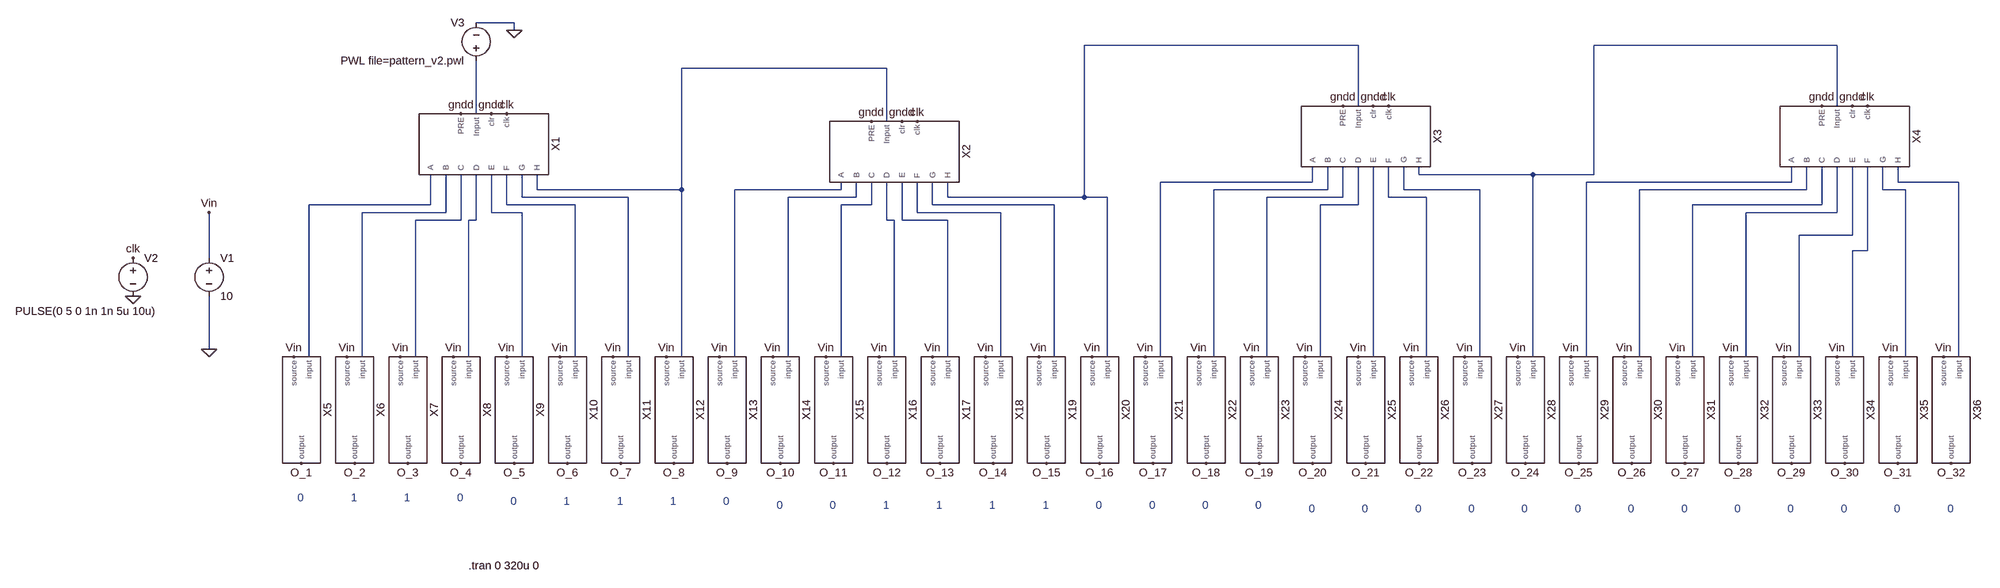
[diagram p0: schematic arduino_control_solarcell.asc]
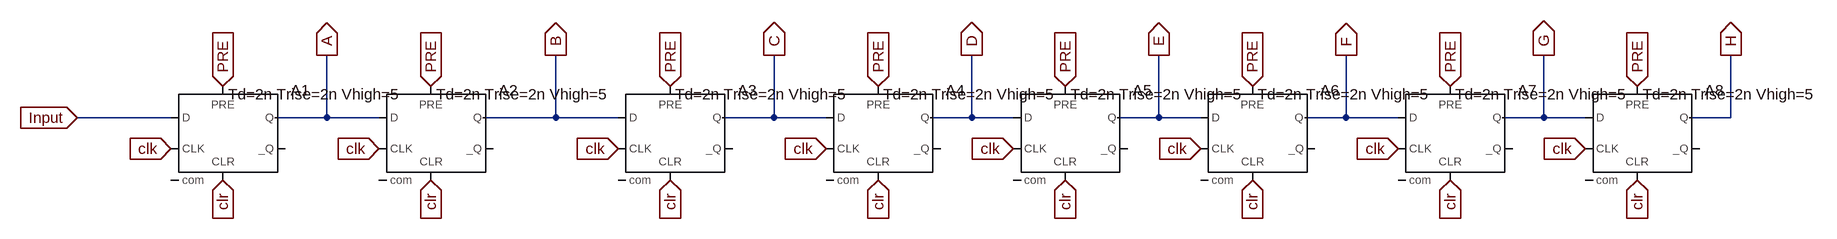
[diagram p1: sub-circuit shift_register.asc]
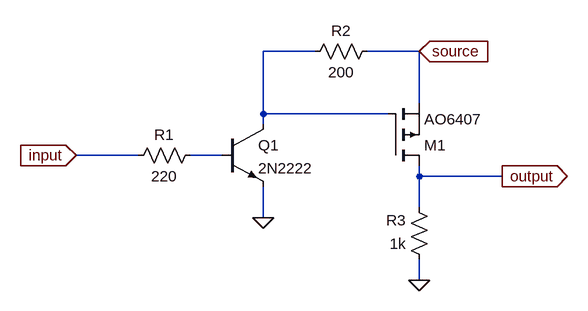
[diagram p2: sub-circuit bloc_transistor.asc]
arduino_control_solarcell.asc, the LTspice schematic file:
Version 4.1
SHEET 1 3296 1164
WIRE -64 -272 -144 -272
WIRE -64 -256 -64 -272
WIRE 1712 -224 1136 -224
WIRE 2720 -224 2208 -224
WIRE 720 -176 288 -176
WIRE 1712 -96 1712 -224
WIRE 2720 -96 2720 -224
WIRE -144 -80 -144 -192
WIRE 720 -64 720 -176
WIRE 1840 48 1840 32
WIRE 2080 48 1840 48
WIRE 2208 48 2208 -224
WIRE 2208 48 2080 48
WIRE 1616 64 1616 32
WIRE 1616 64 1296 64
WIRE 2624 64 2624 32
WIRE 2624 64 2192 64
WIRE 2848 64 2848 32
WIRE 2976 64 2848 64
WIRE -16 80 -16 48
WIRE 288 80 288 -176
WIRE 288 80 -16 80
WIRE 624 80 624 64
WIRE 624 80 400 80
WIRE 1648 80 1648 32
WIRE 1648 80 1408 80
WIRE 1808 80 1808 32
WIRE 1968 80 1808 80
WIRE 2656 80 2656 32
WIRE 2656 80 2304 80
WIRE 2816 80 2816 32
WIRE 2864 80 2816 80
WIRE -48 96 -48 48
WIRE 176 96 -48 96
WIRE 656 96 656 64
WIRE 656 96 512 96
WIRE 848 96 848 64
WIRE 1136 96 1136 -224
WIRE 1136 96 848 96
WIRE 1184 96 1136 96
WIRE 1680 96 1680 32
WIRE 1680 96 1520 96
WIRE 1776 96 1776 32
WIRE 1856 96 1776 96
WIRE -240 112 -240 48
WIRE -240 112 -496 112
WIRE -80 112 -80 48
WIRE 64 112 -80 112
WIRE 688 112 688 64
WIRE 688 112 624 112
WIRE 816 112 816 64
WIRE 1072 112 816 112
WIRE 1712 112 1712 32
WIRE 1712 112 1632 112
WIRE 2688 112 2688 32
WIRE 2688 112 2416 112
WIRE -208 128 -208 48
WIRE -208 128 -384 128
WIRE -112 128 -112 48
WIRE -48 128 -112 128
WIRE 784 128 784 64
WIRE 960 128 784 128
WIRE 2720 128 2720 32
WIRE 2720 128 2528 128
WIRE -176 144 -176 48
WIRE -176 144 -272 144
WIRE -144 144 -144 48
WIRE -144 144 -160 144
WIRE 720 144 720 64
WIRE 736 144 720 144
WIRE 752 144 752 64
WIRE 848 144 752 144
WIRE 2752 176 2752 32
WIRE 2752 176 2640 176
WIRE 2784 208 2784 32
WIRE 2784 208 2752 208
WIRE -928 224 -928 128
WIRE -928 416 -928 304
WIRE -496 432 -496 112
WIRE -384 432 -384 128
WIRE -272 432 -272 144
WIRE -160 432 -160 144
WIRE -48 432 -48 128
WIRE 64 432 64 112
WIRE 176 432 176 96
WIRE 288 432 288 80
WIRE 400 432 400 80
WIRE 512 432 512 96
WIRE 624 432 624 112
WIRE 736 432 736 144
WIRE 848 432 848 144
WIRE 960 432 960 128
WIRE 1072 432 1072 112
WIRE 1184 432 1184 96
WIRE 1296 432 1296 64
WIRE 1408 432 1408 80
WIRE 1520 432 1520 96
WIRE 1632 432 1632 112
WIRE 1744 432 1744 32
WIRE 1856 432 1856 96
WIRE 1968 432 1968 80
WIRE 2080 432 2080 48
WIRE 2192 432 2192 64
WIRE 2304 432 2304 80
WIRE 2416 432 2416 112
WIRE 2528 432 2528 128
WIRE 2640 432 2640 176
WIRE 2752 432 2752 208
WIRE 2864 432 2864 80
WIRE 2976 432 2976 64
FLAG -928 416 0
FLAG -928 128 Vin
FLAG -512 656 O_1
FLAG -400 656 O_2
FLAG -288 656 O_3
FLAG -176 656 O_4
FLAG -64 656 O_5
FLAG 48 656 O_6
FLAG 160 656 O_7
FLAG 272 656 O_8
FLAG 384 656 O_9
FLAG 496 656 O_10
FLAG 608 656 O_11
FLAG 720 656 O_12
FLAG 832 656 O_13
FLAG 944 656 O_14
FLAG 1056 656 O_15
FLAG 1168 656 O_16
FLAG 1280 656 O_17
FLAG 1392 656 O_18
FLAG 1504 656 O_19
FLAG 1616 656 O_20
FLAG 1728 656 O_21
FLAG 1840 656 O_22
FLAG 1952 656 O_23
FLAG 2064 656 O_24
FLAG 2176 656 O_25
FLAG 2288 656 O_26
FLAG 2400 656 O_27
FLAG 2512 656 O_28
FLAG 2624 656 O_29
FLAG 2736 656 O_30
FLAG 2848 656 O_31
FLAG 2960 656 O_32
FLAG -1088 224 clk
FLAG -80 -80 clk
FLAG 784 -64 clk
FLAG 1776 -96 clk
FLAG 2784 -96 clk
FLAG -112 -80 gndd
FLAG -176 -80 gndd
FLAG 752 -64 gndd
FLAG 688 -64 gndd
FLAG 1744 -96 gndd
FLAG 1680 -96 gndd
FLAG 2752 -96 gndd
FLAG 2688 -96 gndd
FLAG -1088 304 0
FLAG -64 -256 0
FLAG -528 432 Vin
FLAG -416 432 Vin
FLAG -304 432 Vin
FLAG -192 432 Vin
FLAG -80 432 Vin
FLAG 32 432 Vin
FLAG 144 432 Vin
FLAG 256 432 Vin
FLAG 368 432 Vin
FLAG 480 432 Vin
FLAG 592 432 Vin
FLAG 704 432 Vin
FLAG 816 432 Vin
FLAG 928 432 Vin
FLAG 1040 432 Vin
FLAG 1152 432 Vin
FLAG 1264 432 Vin
FLAG 1376 432 Vin
FLAG 1488 432 Vin
FLAG 1600 432 Vin
FLAG 1712 432 Vin
FLAG 1824 432 Vin
FLAG 1936 432 Vin
FLAG 2048 432 Vin
FLAG 2160 432 Vin
FLAG 2272 432 Vin
FLAG 2384 432 Vin
FLAG 2496 432 Vin
FLAG 2608 432 Vin
FLAG 2720 432 Vin
FLAG 2832 432 Vin
FLAG 2944 432 Vin
SYMBOL voltage -928 208 R0
WINDOW 123 0 0 Left 0
WINDOW 39 0 0 Left 0
SYMATTR InstName V1
SYMATTR Value 10
SYMBOL voltage -1088 208 R0
WINDOW 3 -248 128 Left 2
WINDOW 123 0 0 Left 0
WINDOW 39 0 0 Left 0
SYMATTR Value PULSE(0 5 0 1n 1n 5u 10u)
SYMATTR InstName V2
SYMBOL voltage -144 -176 R180
WINDOW 0 24 96 Left 2
WINDOW 3 24 16 Left 2
WINDOW 123 0 0 Left 0
WINDOW 39 0 0 Left 0
SYMATTR InstName V3
SYMATTR Value PWL file=pattern_v2.pwl
SYMBOL shift_register -128 -16 R90
SYMATTR InstName X1
SYMBOL shift_register 736 0 R90
SYMATTR InstName X2
SYMBOL shift_register 1728 -32 R90
SYMATTR InstName X3
SYMBOL shift_register 2736 -32 R90
SYMATTR InstName X4
SYMBOL bloc_transistor -512 544 R90
SYMATTR InstName X5
SYMBOL bloc_transistor -400 544 R90
SYMATTR InstName X6
SYMBOL bloc_transistor -288 544 R90
SYMATTR InstName X7
SYMBOL bloc_transistor -176 544 R90
SYMATTR InstName X8
SYMBOL bloc_transistor -64 544 R90
SYMATTR InstName X9
SYMBOL bloc_transistor 48 544 R90
SYMATTR InstName X10
SYMBOL bloc_transistor 160 544 R90
SYMATTR InstName X11
SYMBOL bloc_transistor 272 544 R90
SYMATTR InstName X12
SYMBOL bloc_transistor 384 544 R90
SYMATTR InstName X13
SYMBOL bloc_transistor 496 544 R90
SYMATTR InstName X14
SYMBOL bloc_transistor 608 544 R90
SYMATTR InstName X15
SYMBOL bloc_transistor 720 544 R90
SYMATTR InstName X16
SYMBOL bloc_transistor 832 544 R90
SYMATTR InstName X17
SYMBOL bloc_transistor 944 544 R90
SYMATTR InstName X18
SYMBOL bloc_transistor 1056 544 R90
SYMATTR InstName X19
SYMBOL bloc_transistor 1168 544 R90
SYMATTR InstName X20
SYMBOL bloc_transistor 1280 544 R90
SYMATTR InstName X21
SYMBOL bloc_transistor 1392 544 R90
SYMATTR InstName X22
SYMBOL bloc_transistor 1504 544 R90
SYMATTR InstName X23
SYMBOL bloc_transistor 1616 544 R90
SYMATTR InstName X24
SYMBOL bloc_transistor 1728 544 R90
SYMATTR InstName X25
SYMBOL bloc_transistor 1840 544 R90
SYMATTR InstName X26
SYMBOL bloc_transistor 1952 544 R90
SYMATTR InstName X27
SYMBOL bloc_transistor 2064 544 R90
SYMATTR InstName X28
SYMBOL bloc_transistor 2176 544 R90
SYMATTR InstName X29
SYMBOL bloc_transistor 2288 544 R90
SYMATTR InstName X30
SYMBOL bloc_transistor 2400 544 R90
SYMATTR InstName X31
SYMBOL bloc_transistor 2512 544 R90
SYMATTR InstName X32
SYMBOL bloc_transistor 2624 544 R90
SYMATTR InstName X33
SYMBOL bloc_transistor 2736 544 R90
SYMATTR InstName X34
SYMBOL bloc_transistor 2848 544 R90
SYMATTR InstName X35
SYMBOL bloc_transistor 2960 544 R90
SYMATTR InstName X36
TEXT -160 1048 Left 2 !.tran 0 320u 0
TEXT -520 728 Left 2 ;0
TEXT -408 728 Left 2 ;1
TEXT -296 728 Left 2 ;1
TEXT -184 728 Left 2 ;0
TEXT -72 736 Left 2 ;0
TEXT 40 736 Left 2 ;1
TEXT 152 736 Left 2 ;1
TEXT 264 736 Left 2 ;1
TEXT 376 736 Left 2 ;0
TEXT 488 744 Left 2 ;0
TEXT 600 744 Left 2 ;0
TEXT 712 744 Left 2 ;1
TEXT 824 744 Left 2 ;1
TEXT 936 744 Left 2 ;1
TEXT 1048 744 Left 2 ;1
TEXT 1160 744 Left 2 ;0
TEXT 1272 744 Left 2 ;0
TEXT 1384 744 Left 2 ;0
TEXT 1496 744 Left 2 ;0
TEXT 1608 752 Left 2 ;0
TEXT 1720 752 Left 2 ;0
TEXT 1832 752 Left 2 ;0
TEXT 1944 752 Left 2 ;0
TEXT 2056 752 Left 2 ;0
TEXT 2168 752 Left 2 ;0
TEXT 2280 752 Left 2 ;0
TEXT 2392 752 Left 2 ;0
TEXT 2504 752 Left 2 ;0
TEXT 2616 752 Left 2 ;0
TEXT 2728 752 Left 2 ;0
TEXT 2840 752 Left 2 ;0
TEXT 2952 752 Left 2 ;0

shift_register.asc, the sub-circuit schematic file:
Version 4.1
SHEET 1 2264 680
WIRE -320 112 -464 112
WIRE -80 112 -80 16
WIRE -80 112 -160 112
WIRE 0 112 -80 112
WIRE 272 112 272 16
WIRE 272 112 160 112
WIRE 368 112 272 112
WIRE 608 112 608 16
WIRE 608 112 528 112
WIRE 688 112 608 112
WIRE 912 112 912 16
WIRE 912 112 848 112
WIRE 976 112 912 112
WIRE 1200 112 1200 16
WIRE 1200 112 1136 112
WIRE 1264 112 1200 112
WIRE 1488 112 1488 16
WIRE 1488 112 1424 112
WIRE 1568 112 1488 112
WIRE 1792 112 1792 16
WIRE 1792 112 1728 112
WIRE 1856 112 1792 112
WIRE 2080 112 2080 16
WIRE 2080 112 2016 112
FLAG 0 160 clk
IOPIN 0 160 In
FLAG 368 160 clk
IOPIN 368 160 In
FLAG -320 160 clk
IOPIN -320 160 In
FLAG 688 160 clk
IOPIN 688 160 In
FLAG 976 160 clk
IOPIN 976 160 In
FLAG 1264 160 clk
IOPIN 1264 160 In
FLAG 1568 160 clk
IOPIN 1568 160 In
FLAG 1856 160 clk
IOPIN 1856 160 In
FLAG -240 208 clr
IOPIN -240 208 In
FLAG 80 208 clr
IOPIN 80 208 In
FLAG 448 208 clr
IOPIN 448 208 In
FLAG 768 208 clr
IOPIN 768 208 In
FLAG 1056 208 clr
IOPIN 1056 208 In
FLAG 1344 208 clr
IOPIN 1344 208 In
FLAG 1648 208 clr
IOPIN 1648 208 In
FLAG 1936 208 clr
IOPIN 1936 208 In
FLAG -464 112 Input
IOPIN -464 112 In
FLAG -80 16 A
IOPIN -80 16 Out
FLAG 272 16 B
IOPIN 272 16 Out
FLAG 608 16 C
IOPIN 608 16 Out
FLAG 912 16 D
IOPIN 912 16 Out
FLAG 1200 16 E
IOPIN 1200 16 Out
FLAG 1488 16 F
IOPIN 1488 16 Out
FLAG 1792 16 G
IOPIN 1792 16 Out
FLAG 2080 16 H
IOPIN 2080 16 Out
FLAG -240 64 PRE
IOPIN -240 64 In
FLAG 80 64 PRE
IOPIN 80 64 In
FLAG 448 64 PRE
IOPIN 448 64 In
FLAG 768 64 PRE
IOPIN 768 64 In
FLAG 1056 64 PRE
IOPIN 1056 64 In
FLAG 1344 64 PRE
IOPIN 1344 64 In
FLAG 1648 64 PRE
IOPIN 1648 64 In
FLAG 1936 64 PRE
IOPIN 1936 64 In
SYMBOL Digital\\dflop -240 64 R0
WINDOW 39 8 12 Left 2
SYMATTR SpiceLine Td=2n Trise=2n Vhigh=5
SYMATTR InstName A1
SYMBOL Digital\\dflop 80 64 R0
WINDOW 39 8 12 Left 2
SYMATTR SpiceLine Td=2n Trise=2n Vhigh=5
SYMATTR InstName A2
SYMBOL Digital\\dflop 448 64 R0
WINDOW 39 8 12 Left 2
SYMATTR SpiceLine Td=2n Trise=2n Vhigh=5
SYMATTR InstName A3
SYMBOL Digital\\dflop 768 64 R0
WINDOW 39 8 12 Left 2
SYMATTR SpiceLine Td=2n Trise=2n Vhigh=5
SYMATTR InstName A4
SYMBOL Digital\\dflop 1056 64 R0
WINDOW 39 8 12 Left 2
SYMATTR SpiceLine Td=2n Trise=2n Vhigh=5
SYMATTR InstName A5
SYMBOL Digital\\dflop 1344 64 R0
WINDOW 39 8 12 Left 2
SYMATTR SpiceLine Td=2n Trise=2n Vhigh=5
SYMATTR InstName A6
SYMBOL Digital\\dflop 1648 64 R0
WINDOW 39 8 12 Left 2
SYMATTR SpiceLine Td=2n Trise=2n Vhigh=5
SYMATTR InstName A7
SYMBOL Digital\\dflop 1936 64 R0
WINDOW 39 8 12 Left 2
SYMATTR SpiceLine Td=2n Trise=2n Vhigh=5
SYMATTR InstName A8

bloc_transistor.asc, the sub-circuit schematic file:
Version 4.1
SHEET 1 880 680
WIRE 16 32 -64 32
WIRE 176 32 96 32
WIRE 176 112 176 32
WIRE -64 128 -64 32
WIRE 128 128 -64 128
WIRE -64 144 -64 128
WIRE -256 192 -352 192
WIRE -128 192 -176 192
WIRE 176 224 176 208
WIRE 304 224 176 224
WIRE 176 272 176 224
WIRE -64 288 -64 240
WIRE 176 384 176 352
FLAG -64 288 0
FLAG 176 384 0
FLAG -352 192 input
IOPIN -352 192 In
FLAG 304 224 output
IOPIN 304 224 Out
FLAG 176 32 source
IOPIN 176 32 In
SYMBOL pmos 128 208 M180
SYMATTR InstName M1
SYMATTR Value AO6407
SYMBOL npn -128 144 R0
SYMATTR InstName Q1
SYMATTR Value 2N2222
SYMBOL res -160 176 R90
WINDOW 0 0 56 VBottom 2
WINDOW 3 32 56 VTop 2
SYMATTR InstName R1
SYMATTR Value 220
SYMBOL res 112 16 R90
WINDOW 0 0 56 VBottom 2
WINDOW 3 32 56 VTop 2
SYMATTR InstName R2
SYMATTR Value 200
SYMBOL res 192 368 R180
WINDOW 0 36 76 Left 2
WINDOW 3 36 40 Left 2
SYMATTR InstName R3
SYMATTR Value 1k

The netlist it stands for:
* arduino_control_solarcell.asc
V1 Vin 0 10
V2 clk 0 PULSE(0 5 0 1n 1n 5u 10u)
V3 N004 0 PWL file=pattern_v2.pwl
X§X1 clk gndd N004 gndd N003 N013 N018 N024 N028 N027 N023 N017 shift_register
X§X2 clk gndd N003 gndd N001 N020 N025 N030 N029 N019 N014 N008 shift_register
X§X3 clk gndd N001 gndd N002 N010 N016 N033 N021 N015 N009 N005 shift_register
X§X4 clk gndd N002 gndd N007 N012 N032 N031 N026 N022 N011 N006 shift_register
X§X5 N017 Vin O_1 bloc_transistor
X§X6 N023 Vin O_2 bloc_transistor
X§X7 N027 Vin O_3 bloc_transistor
X§X8 N028 Vin O_4 bloc_transistor
X§X9 N024 Vin O_5 bloc_transistor
X§X10 N018 Vin O_6 bloc_transistor
X§X11 N013 Vin O_7 bloc_transistor
X§X12 N003 Vin O_8 bloc_transistor
X§X13 N008 Vin O_9 bloc_transistor
X§X14 N014 Vin O_10 bloc_transistor
X§X15 N019 Vin O_11 bloc_transistor
X§X16 N029 Vin O_12 bloc_transistor
X§X17 N030 Vin O_13 bloc_transistor
X§X18 N025 Vin O_14 bloc_transistor
X§X19 N020 Vin O_15 bloc_transistor
X§X20 N001 Vin O_16 bloc_transistor
X§X21 N005 Vin O_17 bloc_transistor
X§X22 N009 Vin O_18 bloc_transistor
X§X23 N015 Vin O_19 bloc_transistor
X§X24 N021 Vin O_20 bloc_transistor
X§X25 N033 Vin O_21 bloc_transistor
X§X26 N016 Vin O_22 bloc_transistor
X§X27 N010 Vin O_23 bloc_transistor
X§X28 N002 Vin O_24 bloc_transistor
X§X29 N006 Vin O_25 bloc_transistor
X§X30 N011 Vin O_26 bloc_transistor
X§X31 N022 Vin O_27 bloc_transistor
X§X32 N026 Vin O_28 bloc_transistor
X§X33 N031 Vin O_29 bloc_transistor
X§X34 N032 Vin O_30 bloc_transistor
X§X35 N012 Vin O_31 bloc_transistor
X§X36 N007 Vin O_32 bloc_transistor

* block symbol definitions
.subckt shift_register clk clr Input PRE H G F E D C B A
A1 Input 0 clk PRE clr 0 A 0 DFLOP Td=2n Trise=2n Vhigh=5
A2 A 0 clk PRE clr 0 B 0 DFLOP Td=2n Trise=2n Vhigh=5
A3 B 0 clk PRE clr 0 C 0 DFLOP Td=2n Trise=2n Vhigh=5
A4 C 0 clk PRE clr 0 D 0 DFLOP Td=2n Trise=2n Vhigh=5
A5 D 0 clk PRE clr 0 E 0 DFLOP Td=2n Trise=2n Vhigh=5
A6 E 0 clk PRE clr 0 F 0 DFLOP Td=2n Trise=2n Vhigh=5
A7 F 0 clk PRE clr 0 G 0 DFLOP Td=2n Trise=2n Vhigh=5
A8 G 0 clk PRE clr 0 H 0 DFLOP Td=2n Trise=2n Vhigh=5
.ends shift_register

.subckt bloc_transistor input source output
M1 output N001 source source AO6407
Q1 N001 N002 0 0 2N2222
R1 N002 input 220
R2 source N001 200
R3 0 output 1k
.ends bloc_transistor

.model NPN NPN
.model PNP PNP
.lib standard.bjt
.model NMOS NMOS
.model PMOS PMOS
.lib standard.mos
.tran 0 320u 0
* 0
* 1
* 1
* 0
* 0
* 1
* 1
* 1
* 0
* 0
* 0
* 1
* 1
* 1
* 1
* 0
* 0
* 0
* 0
* 0
* 0
* 0
* 0
* 0
* 0
* 0
* 0
* 0
* 0
* 0
* 0
* 0
.backanno
.end

* Results of the author's LTspice run, read from the files saved beside the schematic
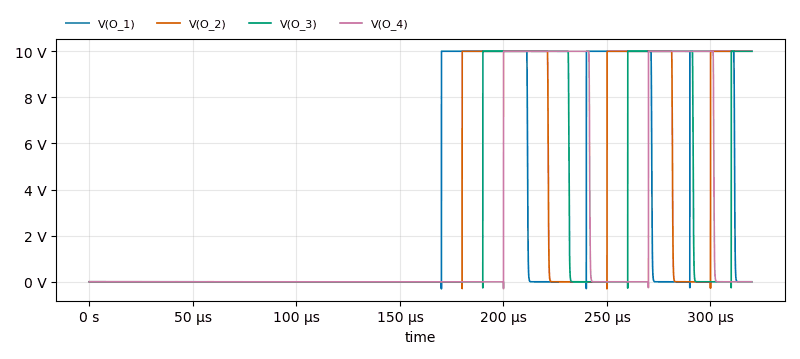
[diagram p3: Transient Analysis of arduino_control_solarcell.asc, plotted from the saved traces]
* Transient Analysis, 1 run:
*   V(O_1): min -305.5 mV, max 10 V, average 2.969 V, rms 5.438 V, last 18.66 µV
*   V(O_2): min -302.5 mV, max 10 V, average 2.916 V, rms 5.393 V, last 10 V
*   V(O_3): min -272.9 mV, max 10 V, average 2.604 V, rms 5.095 V, last 10 V
*   V(O_4): min -301.5 mV, max 10 V, average 2.291 V, rms 4.779 V, last 18.05 µV